# Altium schematic sheet PMSM_M007R_Fan.SchDoc
size C
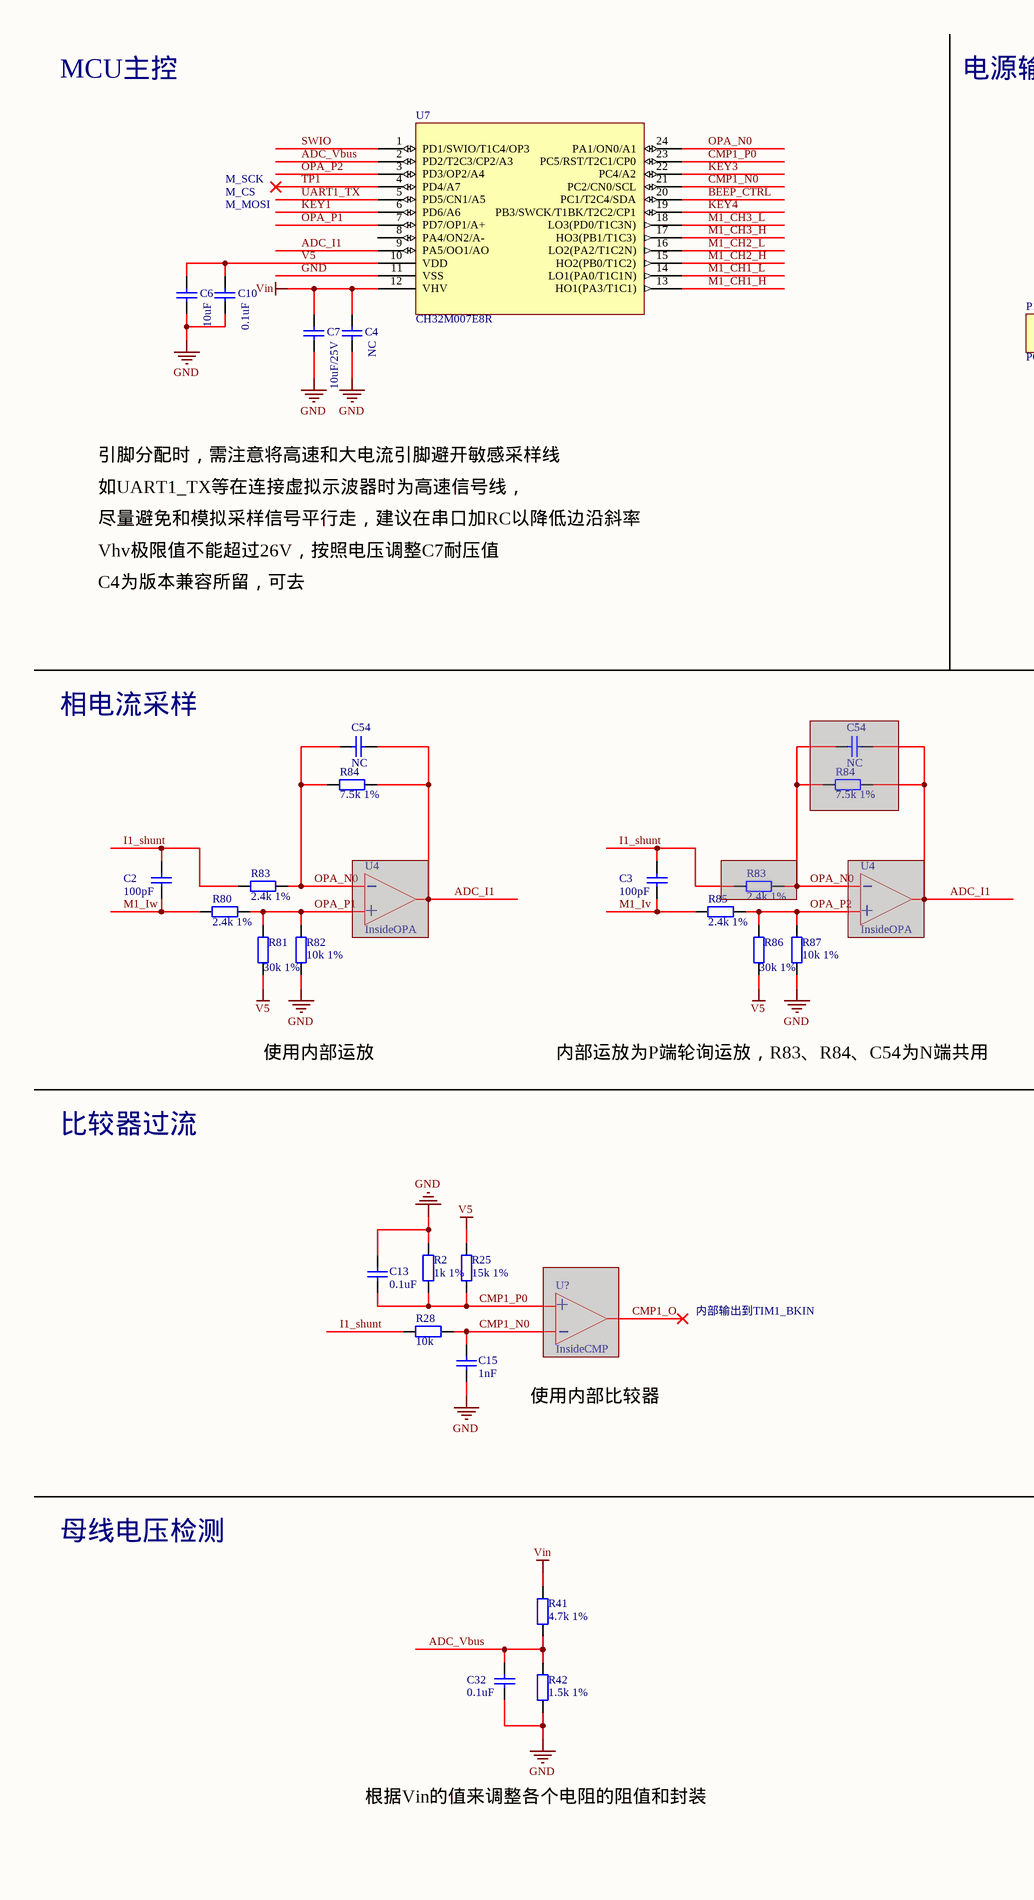
[diagram p0: PMSM_M007R_Fan.SchDoc, left]
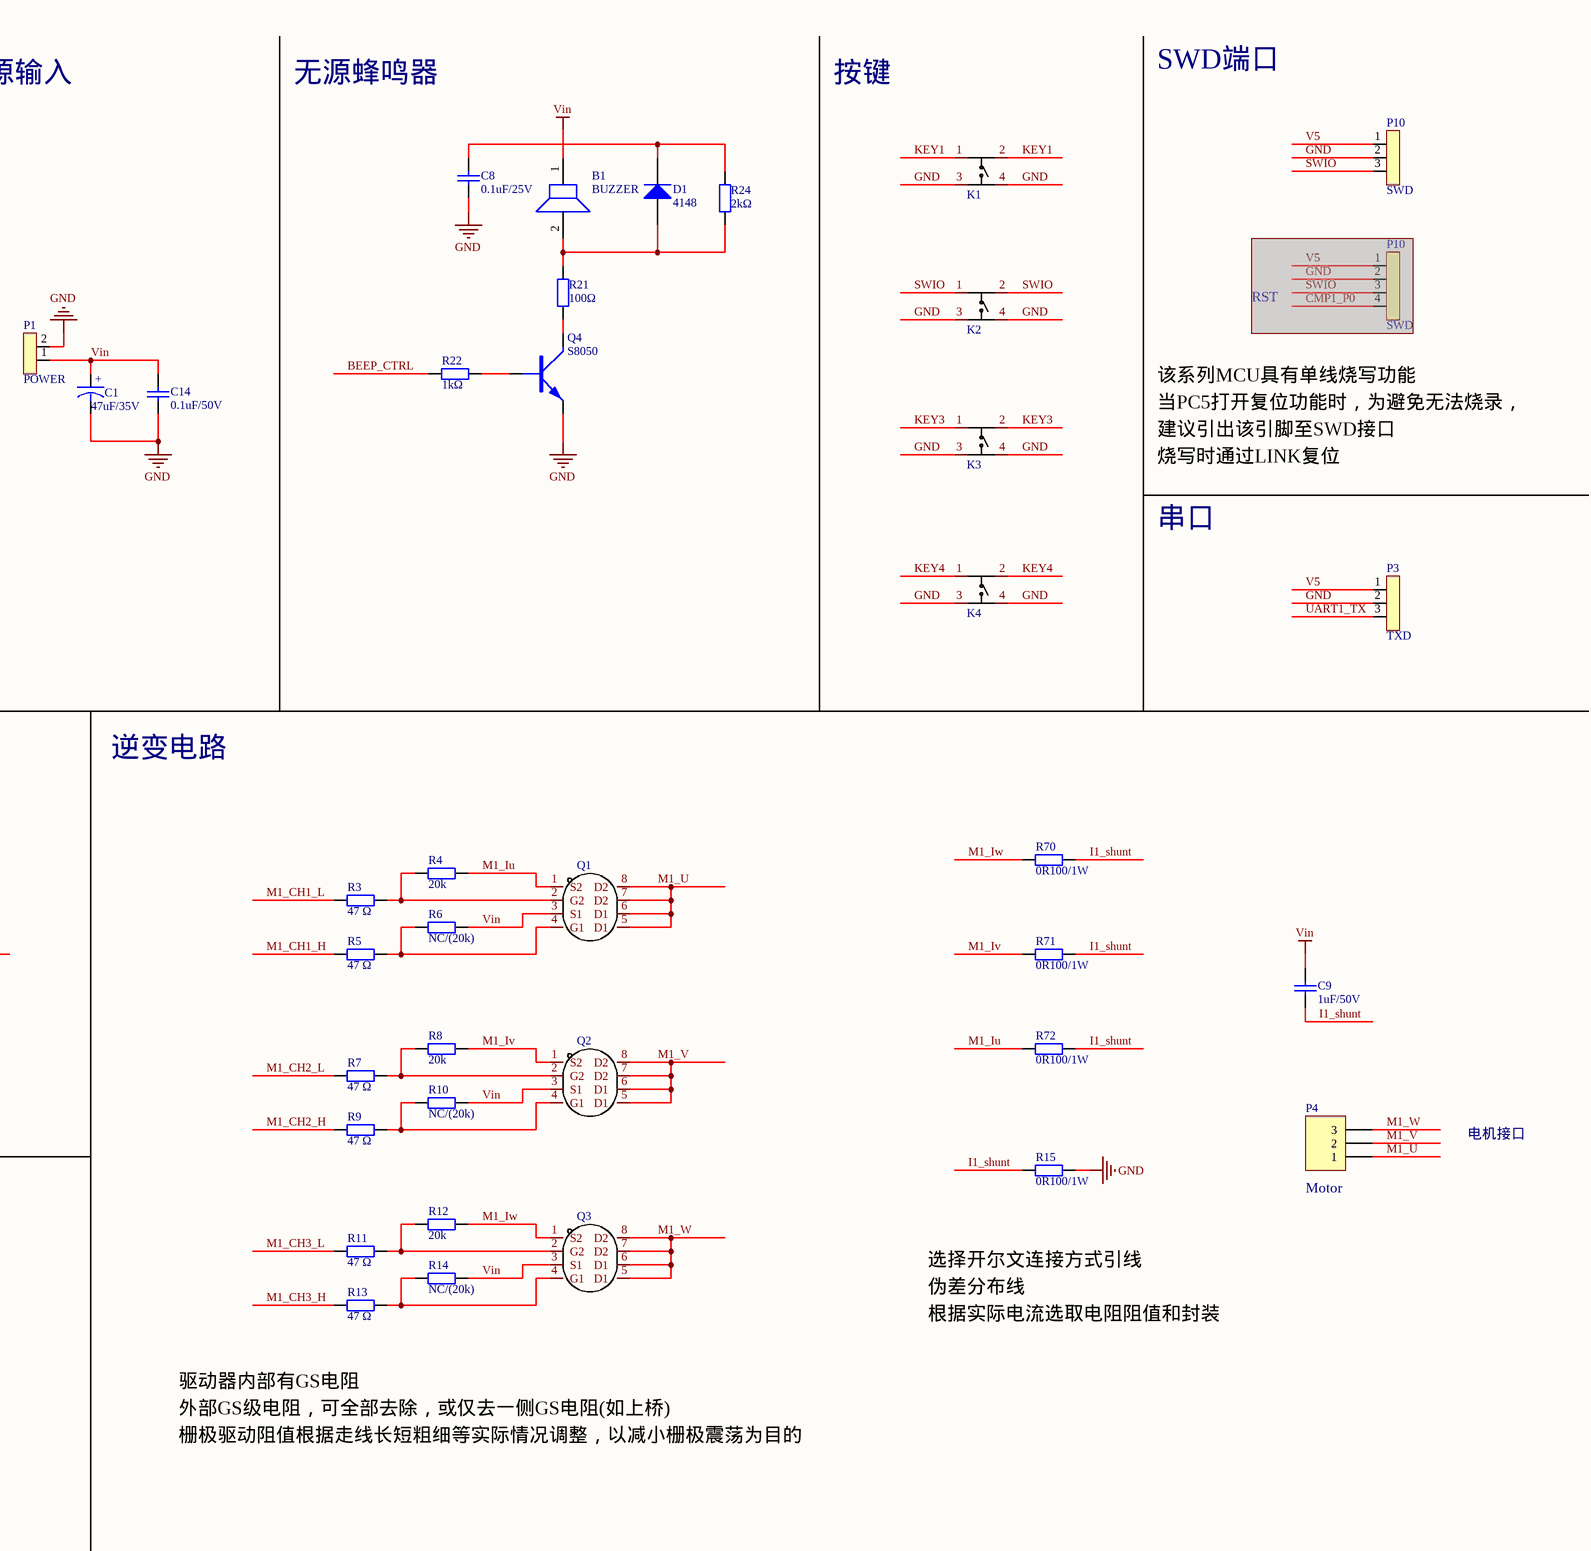
[diagram p1: PMSM_M007R_Fan.SchDoc, right]

## Parts
(Parts that share a designator on the sheet are numbered #1, #2 ... from top to bottom, then left to right.)
B1  BUZZER  [M_BUZZER12550]
C1  47uF/35V  [M_C_RB_D5F2]
C2  100pF  [M_C0402-]
C3  100pF  [M_C0402-]
C4  NC  [M_C0603]
C6  10uF  [M_C0603]
C7  10uF/25V  [M_C0805]
C8  0.1uF/25V  [M_C0402-]
C9  1uF/50V  [M_C0805]
C10  0.1uF  [M_C0402-]
C13  0.1uF  [M_C0402-]
C14  0.1uF/50V  [M_C0402-]
C15  1nF  [M_C0402-]
C32  0.1uF  [M_C0402-]
C54#1  NC  [M_C0402-]
C54#2  NC  [M_C0402-]  (masked out: inside a compile mask, not in the netlist)
D1  4148  [SOD-323]
K1  KH-6X6X8H-STM  [KEY2-SMD]  (value not drawn)
K2  KH-6X6X8H-STM  [KEY2-SMD]  (value not drawn)
K3  KH-6X6X8H-STM  [KEY2-SMD]  (value not drawn)
K4  KH-6X6X8H-STM  [KEY2-SMD]  (value not drawn)
P1  POWER  [WJ15EDGRC3.81-2]
P3  TXD  [HDR2.54-LI-3P]
P4  MHDR1X3  [WJ15EDGRC3.81-3]  (value not drawn)
P10#1  SWD  [HDR2.54-LI-3P]
P10#2  SWD  [HDR2.54-LI-4P]  (masked out: inside a compile mask, not in the netlist)
Q1  (no value)  [SOP8]
Q2  (no value)  [SOP8]
Q3  (no value)  [SOP8]
Q4  S8050  [SOT23]
R2  1k 1%  [M_R0402-]
R3  47 Ω  [M_R0402-]
R4  20k  [M_R0402-]
R5  47 Ω  [M_R0402-]
R6  NC/(20k)  [M_R0402-]
R7  47 Ω  [M_R0402-]
R8  20k  [M_R0402-]
R9  47 Ω  [M_R0402-]
R10  NC/(20k)  [M_R0402-]
R11  47 Ω  [M_R0402-]
R12  20k  [M_R0402-]
R13  47 Ω  [M_R0402-]
R14  NC/(20k)  [M_R0402-]
R15  0R100/1W  [M_R1206-]
R21  100Ω  [M_R0603]
R22  1kΩ  [M_R0603]
R24  2kΩ  [M_R0805]
R25  15k 1%  [M_R0402-]
R28  10k  [M_R0402-]
R41  4.7k 1%  [M_R0603]
R42  1.5k 1%  [M_R0402-]
R70  0R100/1W  [M_R1206-]
R71  0R100/1W  [M_R1206-]
R72  0R100/1W  [M_R1206-]
R80  2.4k 1%  [M_R0402-]
R81  30k 1%  [M_R0402-]
R82  10k 1%  [M_R0402-]
R83#1  2.4k 1%  [M_R0402-]
R83#2  2.4k 1%  [M_R0402-]  (masked out: inside a compile mask, not in the netlist)
R84#1  7.5k 1%  [M_R0402-]
R84#2  7.5k 1%  [M_R0402-]  (masked out: inside a compile mask, not in the netlist)
R85  2.4k 1%  [M_R0402-]
R86  30k 1%  [M_R0402-]
R87  10k 1%  [M_R0402-]
U4#1  InsideOPA  (masked out: inside a compile mask, not in the netlist)
U4#2  InsideOPA  (masked out: inside a compile mask, not in the netlist)
U7  CH32M007E8R  [QSOP24]
U?  InsideCMP  (masked out: inside a compile mask, not in the netlist)

## Nets
GND: C1.2 C4.2 C6.2 C7.2 C8.2 C10.2 C13.2 C14.2 C15.1 C32.2 K1.3(C) K1.4(D) K2.3(C) K2.4(D) K3.3(C) K3.4(D) K4.3(C) K4.4(D) P1.2 P3.2 P10#1.2 Q4.2(E) R2.1 R15.1 R42.1 R82.1 R87.1 U7.11(VSS)
V5: C6.1 C10.1 P3.1 P10#1.1 R25.2 R81.1 R86.1 U7.10(VDD)
Vin: B1.1 C1.1 C4.1 C7.1 C9.1 C14.1 P1.1 Q1.3(S1) Q2.3(S1) Q3.3(S1) R6.1 R10.1 R14.1 R41.2 U7.12(VHV)
ADC_I1: C54#1.1 R84#1.2 U7.9(PA5/OO1/AO)
ADC_Vbus: C32.1 R41.1 R42.2 U7.2(PD2/T2C3/CP2/A3)
BEEP_CTRL: R22.2 U7.20(PC1/T2C4/SDA)
CMP1_N0: C15.2 R28.2 U7.21(PC2/CN0/SCL)
CMP1_P0: C13.1 R2.2 R25.1 U7.23(PC5/RST/T2C1/CP0)
I1_shunt: C2.1 C3.1 C9.2 R15.2 R28.1 R70.1 R71.1 R72.1 R83#1.1
KEY1: K1.1(A) K1.2(B) U7.6(PD6/A6)
KEY3: K3.1(A) K3.2(B) U7.22(PC4/A2)
KEY4: K4.1(A) K4.2(B) U7.19(PB3/SWCK/T1BK/T2C2/CP1)
M1_CH1_H: R5.2 U7.13(HO1(PA3/T1C1))
M1_CH1_L: R3.2 U7.14(LO1(PA0/T1C1N))
M1_CH2_H: R9.2 U7.15(HO2(PB0/T1C2))
M1_CH2_L: R7.2 U7.16(LO2(PA2/T1C2N))
M1_CH3_H: R13.2 U7.17(HO3(PB1/T1C3))
M1_CH3_L: R11.2 U7.18(LO3(PD0/T1C3N))
M1_Iu: Q1.1(S2) R4.1 R72.2
M1_Iv: C3.2 Q2.1(S2) R8.1 R71.2 R85.1
M1_Iw: C2.2 Q3.1(S2) R12.1 R70.2 R80.1
M1_U: P4.1 Q1.5(D1) Q1.6(D1) Q1.7(D2) Q1.8(D2)
M1_V: P4.2 Q2.5(D1) Q2.6(D1) Q2.7(D2) Q2.8(D2)
M1_W: P4.3 Q3.5(D1) Q3.6(D1) Q3.7(D2) Q3.8(D2)
OPA_N0: C54#1.2 R83#1.2 R84#1.1 U7.24(PA1/ON0/A1)
OPA_P1: R80.2 R81.2 R82.2 U7.7(PD7/OP1/A+)
OPA_P2: R85.2 R86.2 R87.2 U7.3(PD3/OP2/A4)
SWIO: K2.1(A) K2.2(B) P10#1.3 U7.1(PD1/SWIO/T1C4/OP3)
TP1: U7.4(PD4/A7)
UART1_TX: P3.3 U7.5(PD5/CN1/A5)
NetB1_2: B1.2 D1.1(A) R21.2 R24.1
NetC8_1: C8.1 D1.2(K) R24.2
NetQ1_2: Q1.2(G2) R3.1 R4.2
NetQ1_4: Q1.4(G1) R5.1 R6.2
NetQ2_2: Q2.2(G2) R7.1 R8.2
NetQ2_4: Q2.4(G1) R9.1 R10.2
NetQ3_2: Q3.2(G2) R11.1 R12.2
NetQ3_4: Q3.4(G1) R13.1 R14.2
NetQ4_1: Q4.1(B) R22.1
NetQ4_3: Q4.3(C) R21.1

Not connected (* = marked no-connect by the designer): U7 8(PA4/ON2/A-)

## Notes on the sheet
- MCU主控
- 电源输入
- 无源蜂鸣器
- 按键
- SWD端口
- M_SCK
- M_CS
- M_MOSI
- RST
- 该系列MCU具有单线烧写功能
- 当PC5打开复位功能时，为避免无法烧录，
- 引脚分配时，需注意将高速和大电流引脚避开敏感采样线
- 建议引出该引脚至SWD接口
- 烧写时通过LINK复位
- 如UART1_TX等在连接虚拟示波器时为高速信号线，
- 尽量避免和模拟采样信号平行走，建议在串口加RC以降低边沿斜率
- 串口
- C4为版本兼容所留，可去
- Vhv极限值不能超过26V，按照电压调整C7耐压值
- 相电流采样
- 逆变电路
- 使用内部运放
- 内部运放为P端轮询运放，R83、R84、C54为N端共用
- 电机接口
- 比较器过流
- (near P4) Motor
- 选择开尔文连接方式引线
- 伪差分布线
- 根据实际电流选取电阻阻值和封装
- 内部输出到TIM1_BKIN
- 驱动器内部有GS电阻
- 外部GS级电阻，可全部去除，或仅去一侧GS电阻(如上桥)
- 使用内部比较器
- 栅极驱动阻值根据走线长短粗细等实际情况调整，以减小栅极震荡为目的
- 母线电压检测
- 根据Vin的值来调整各个电阻的阻值和封装
- Labels drawn without touching a wire or pin: OPA_N0
- (in symbol CAPACITOR POL_2) +
- (in symbol InsideOPA) +
- (in symbol InsideOPA2) +

## Library data of the parts
C1 = CAPACITOR POL_2: Capacitor; Value: 47uF/35V
C2-C4 C6-C10 C13-C15 C32 C54#1 C54#2 = Cap Semi: Capacitor (Semiconductor SIM Model); Published: 8-Jun-2000; LatestRevisionDate: 17-Jul-2002; LatestRevisionNote: Re-released for DXP Platform.; PackageReference: C0805; Publisher: Altium Limited
  C2 C3: Value: 100pF
  C4 C54#1 C54#2: Value: NC
  C6: Value: 10uF
  C7: Value: 10uF/25V
  C8: Value: 0.1uF/25V
  C9: Value: 1uF/50V
  C10 C13 C32: Value: 0.1uF
  C14: Value: 0.1uF/50V
  C15: Value: 1nF
D1 = Diode 1N4148: High Conductance Fast Diode; Published: 8-Jun-2000; LatestRevisionDate: 17-Jul-2002; LatestRevisionNote: Re-released for DXP Platform.; DatasheetDocument: 1997; PackageReference: DO-35; Publisher: Altium Limited; Code_JEDEC: DO-204-AH; ComponentLink1Description: Manufacturer Link; ComponentLink1URL: http://www.fairchildsemi.com/; ComponentLink2Description: Datasheet; ComponentLink2URL: http://www.fairchildsemi.com/ds/1N%2F1N4148.pdf
K1-K4 = KH-6X6X8H-STM: Add into BOM: yes; Contact Current: 50mA; Voltage Rating (DC): 12V; Mechanical Life: 80000; Switch Length: 6mm; Name: KH-6X6X8H-STM; Symbol: KH-6X6X8H-STM; Device: KH-6X6X8H-STM; LCSC Part Name: KH-6X6X8H-STM; Supplier Part: C2837534; Manufacturer Part: KH-6X6X8H-STM; Supplier Footprint: SMD; JLCPCB Part Class: Extended Part; Datasheet: https://atta.szlcsc.com/upload/public/pdf/source/20210608/C2837534_94EAC7D8AFBB996E2814FACF50FEEF85.pdf; Supplier: LCSC; Convert to PCB: yes; Voltage Rating (AC): -; Power Rating: -; With Lamp: -; Operating Force: -; Operating Temperature: -; IP Rating: -; Switch Width: 6mm; Switch Height: -
P1 = 2PIN
P3 P10#1 = 3PIN
P4 = MHDR1X3: Header, 3-Pin; LatestRevisionDate: 17-Jul-2002; LatestRevisionNote: Re-released for DXP Platform.; Publisher: Altium Limited
P10#2 = 4PIN
Q1-Q3 = NP9926BSR-G: Add into BOM: yes; Drain Source Voltage (Vdss): 20V; Continuous Drain Current (Id): 6A; Power Dissipation (Pd): 1.25W; Gate Threshold Voltage (Vgs(th)@Id): 700mV@250uA; Total Gate Charge (Qg@Vgs): 12nC@4.5V; Input Capacitance (Ciss@Vds): 900pF@10V; Reverse Transfer Capacitance (Crss@Vds): 100pF@10V; Symbol: NP9926BSR-G; Device: NP9926BSR-G; Supplier Part: C2991134; Manufacturer Part: NP9926BSR-G; Supplier Footprint: SOP-8; JLCPCB Part Class: Extended Part; Datasheet: https://atta.szlcsc.com/upload/public/pdf/source/20220426/45EDAE8AA532D945771DBC41E7CE2370.pdf; Supplier: LCSC; Convert to PCB: yes
Q4 = NPN1
R2-R15 R21 R22 R24 R25 R28 R41 R42 R70-R72 R80-R82 R83#1 R83#2 R84#1 R84#2 R85-R87 = Res2: Resistor; Published: 8-Jun-2000; LatestRevisionDate: 17-Jul-2002; LatestRevisionNote: Re-released for DXP Platform.; PackageReference: AXIAL-0.4; Publisher: Altium Limited
  R2: Value: 1k 1%
  R3 R5 R7 R9 R11 R13: Value: 47 Ω
  R4 R8 R12: Value: 20k
  R6 R10 R14: Value: NC/(20k)
  R15 R70-R72: Value: 0R100/1W
  R21: Value: 100Ω
  R22: Value: 1kΩ
  R24: Value: 2kΩ
  R25: Value: 15k 1%
  R28: Value: 10k
  R41: Value: 4.7k 1%
  R42: Value: 1.5k 1%
  R80 R83#1 R83#2 R85: Value: 2.4k 1%
  R81 R86: Value: 30k 1%
  R82 R87: Value: 10k 1%
  R84#1 R84#2: Value: 7.5k 1%
U7 = CH32M007E8R6: RISC-V MCU, 48MHz, OPA/CMP/UART/I2C, 24V P/NMOS gate driver for motor
U? = InsideOPA2